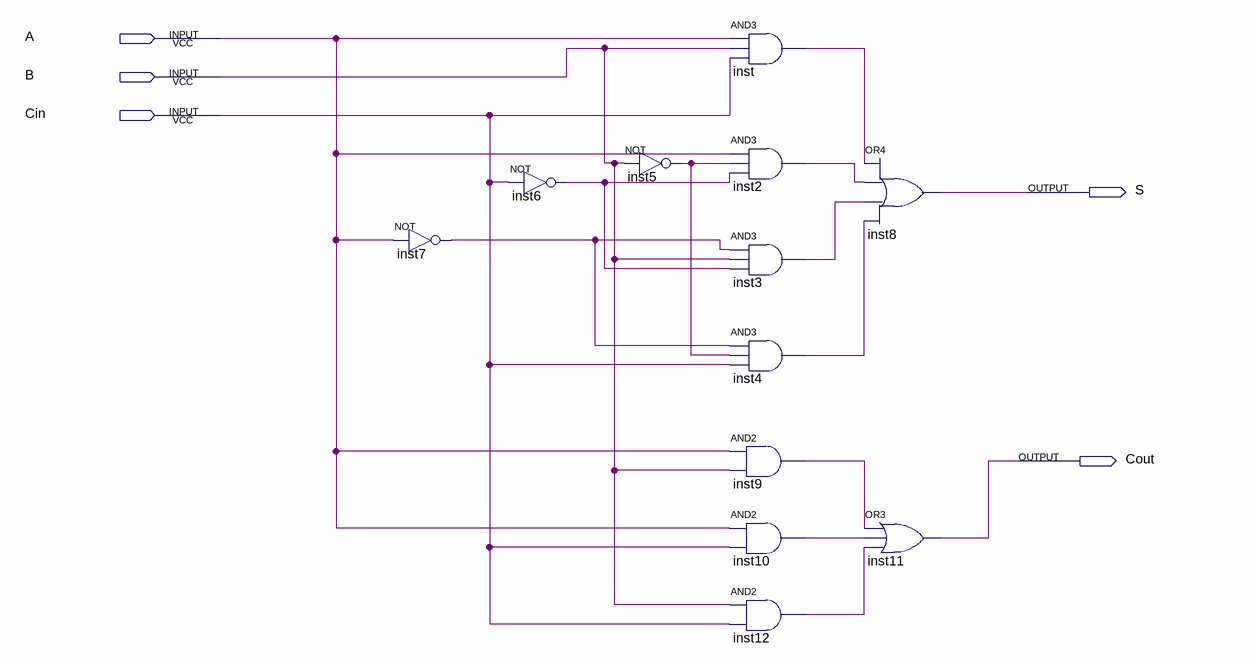
[diagram p0: schematic sheet]
// Quartus schematic Adder_1bit.bdf as structural Verilog: 12 symbols, 5 pins
module Adder_1bit (
  input  A,
  input  B,
  input  Cin,
  output S,
  output Cout
);

  wire inst2_out, inst3_out, inst4_out, inst5_out, inst6_out, inst7_out, inst9_out, inst10_out, inst12_out,
       inst_out;

  not inst7 (inst7_out, A);
  not inst6 (inst6_out, Cin);
  not inst5 (inst5_out, B);
  and inst (inst_out, A, B, Cin);
  and inst2 (inst2_out, A, inst5_out, inst6_out);
  and inst3 (inst3_out, inst7_out, B, inst6_out);
  and inst4 (inst4_out, inst7_out, inst5_out, Cin);
  and inst9 (inst9_out, A, B);
  and inst10 (inst10_out, A, Cin);
  and inst12 (inst12_out, B, Cin);
  or inst8 (S, inst_out, inst2_out, inst3_out, inst4_out);
  or inst11 (Cout, inst9_out, inst10_out, inst12_out);
endmodule
